# Altium schematic sheet rs422-selectable.SchDoc
size A
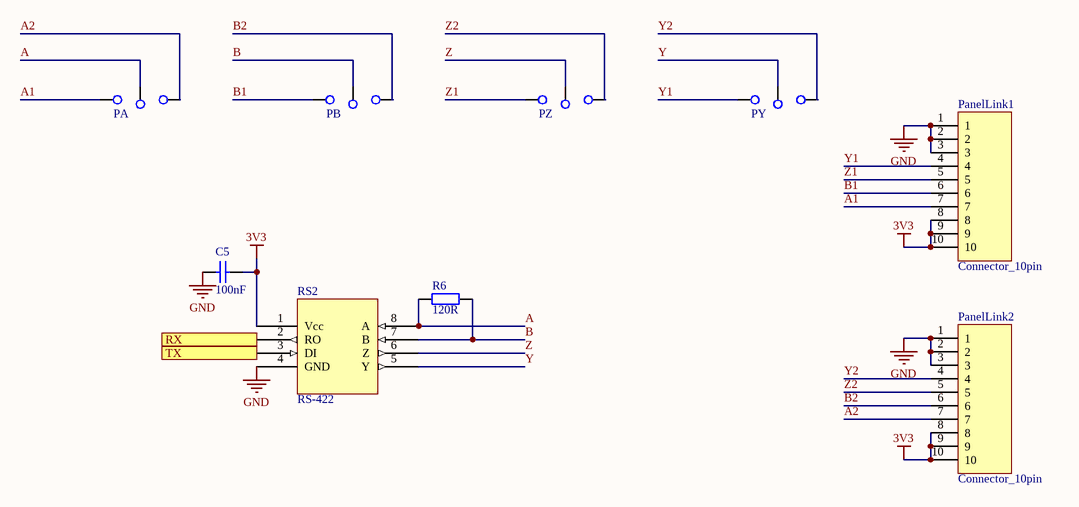
[diagram p0: rs422-selectable.SchDoc]

## Parts
C5  100nF  [FP_0805_CAP_085]
PA  PA  [JUMPER_3]  (value not drawn)
PanelLink1  Connector_10pin  [FP_CONN10_SZK_ALLO]
PanelLink2  Connector_10pin  [FP_CONN10_SZK_ALLO]
PB  PB  [JUMPER_3]  (value not drawn)
PY  PY  [JUMPER_3]  (value not drawn)
PZ  PZ  [JUMPER_3]  (value not drawn)
R6  120R  [FP_0805_RES]
RS2  RS-422  [NSOIC-8]

## Ports
RX (out), TX (in)

## Nets
3V3: C5.1 PanelLink1.8 PanelLink1.9 PanelLink1.10 PanelLink2.8 PanelLink2.9 PanelLink2.10 RS2.1(Vcc)
GND: C5.2 PanelLink1.1 PanelLink1.2 PanelLink1.3 PanelLink2.1 PanelLink2.2 PanelLink2.3 RS2.4(GND)
A: PA.2(Cmid) R6.1 RS2.8(A)
A1: PA.1(C1) PanelLink1.7
A2: PA.3(C2) PanelLink2.7
B: PB.2(Cmid) R6.2 RS2.7(B)
B1: PanelLink1.6 PB.1(C1)
B2: PanelLink2.6 PB.3(C2)
RX: RS2.2(RO) ; port RX
TX: RS2.3(DI) ; port TX
Y: PY.2(Cmid) RS2.5(Y)
Y1: PanelLink1.4 PY.1(C1)
Y2: PanelLink2.4 PY.3(C2)
Z: PZ.2(Cmid) RS2.6(Z)
Z1: PanelLink1.5 PZ.1(C1)
Z2: PanelLink2.5 PZ.3(C2)

## Library data of the parts
C5 = CAP 100nF: Capacitor; Tolerance: +80%/-20%; Voltage: 25V; Reference: 1759167; Name: SMD Multilayer Ceramic Capacitor, 0805; Supplier: Farnell; Value: 100nF
PA PB PY PZ = JUMPER_3
R6 = RES 120R: Resistor; Tolerance: 5%; Power: 125mW; Name: YAGEO (PHYCOMP)  RC0805JR-07120RL  SMD Chip Resistor, Thick Film, 120 ohm; Reference: 9233890; Supplier: Farnell; Value: 120R
RS2 = ISL83071: RS-422 transceiver 3V3